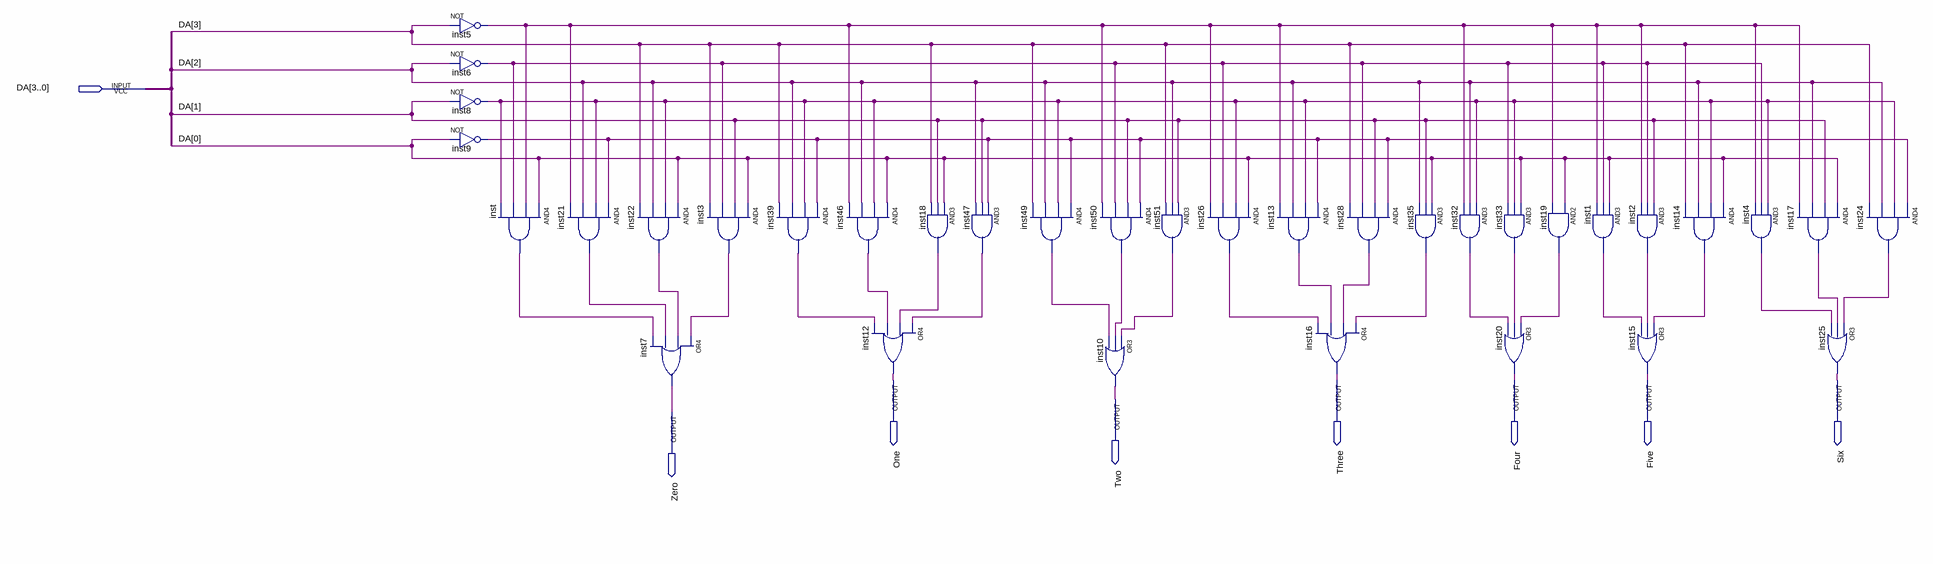
[diagram p0: schematic sheet]
// Quartus schematic secondsevenseg.bdf as structural Verilog: 35 symbols, 8 pins
module secondsevenseg (
  input  [3:0] DA,
  output One,
  output Three,
  output Four,
  output Five,
  output Six,
  output Two,
  output Zero
);

  wire inst1_out, inst2_out, inst3_out, inst4_out, inst5_out, inst6_out, inst8_out, inst9_out, inst13_out,
       inst14_out, inst17_out, inst18_out, inst19_out, inst21_out, inst22_out, inst24_out, inst26_out,
       inst28_out, inst32_out, inst33_out, inst35_out, inst39_out, inst46_out, inst47_out, inst49_out,
       inst50_out, inst51_out, inst_out;

  not inst5 (inst5_out, DA[3]);
  not inst6 (inst6_out, DA[2]);
  not inst8 (inst8_out, DA[1]);
  not inst9 (inst9_out, DA[0]);
  and inst (inst_out, DA[0], inst5_out, inst6_out, inst8_out);
  and inst21 (inst21_out, inst9_out, inst8_out, DA[2], inst5_out);
  and inst22 (inst22_out, DA[0], inst8_out, DA[2], DA[3]);
  or inst7 (Zero, inst3_out, inst22_out, inst21_out, inst_out);
  and inst3 (inst3_out, DA[0], DA[1], inst6_out, DA[3]);
  and inst39 (inst39_out, inst9_out, inst8_out, DA[2], DA[3]);
  and inst46 (inst46_out, DA[0], inst8_out, DA[2], inst5_out);
  or inst12 (One, inst47_out, inst18_out, inst46_out, inst39_out);
  and inst47 (inst47_out, inst9_out, DA[1], DA[2]);
  and inst18 (inst18_out, DA[0], DA[1], DA[3]);
  and inst49 (inst49_out, inst9_out, inst8_out, DA[2], DA[3]);
  and inst50 (inst50_out, inst9_out, DA[1], inst6_out, inst5_out);
  or inst10 (Two, inst51_out, inst50_out, inst49_out);
  and inst51 (inst51_out, DA[1], DA[2], DA[3]);
  and inst26 (inst26_out, DA[0], inst8_out, inst6_out, inst5_out);
  and inst13 (inst13_out, inst9_out, inst8_out, DA[2], inst5_out);
  or inst16 (Three, inst35_out, inst28_out, inst13_out, inst26_out);
  and inst28 (inst28_out, inst9_out, DA[1], inst6_out, DA[3]);
  and inst35 (inst35_out, DA[0], DA[1], DA[2]);
  and inst32 (inst32_out, inst8_out, DA[2], inst5_out);
  and inst33 (inst33_out, DA[0], inst8_out, inst6_out);
  or inst20 (Four, inst19_out, inst33_out, inst32_out);
  and inst19 (inst19_out, DA[0], inst5_out);
  and inst1 (inst1_out, DA[0], inst6_out, inst5_out);
  and inst14 (inst14_out, DA[0], inst8_out, DA[2], DA[3]);
  and inst2 (inst2_out, DA[1], inst6_out, inst5_out);
  or inst15 (Five, inst14_out, inst2_out, inst1_out);
  and inst4 (inst4_out, inst8_out, inst6_out, inst5_out);
  and inst17 (inst17_out, DA[0], DA[1], DA[2], inst5_out);
  or inst25 (Six, inst24_out, inst17_out, inst4_out);
  and inst24 (inst24_out, inst9_out, inst8_out, DA[2], DA[3]);
endmodule
